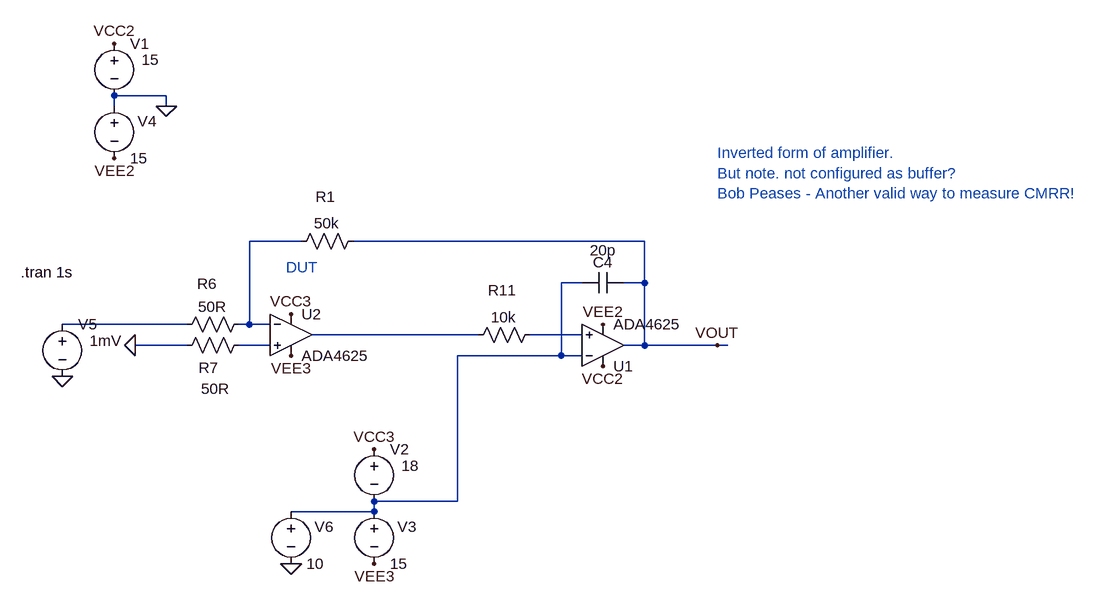
[diagram p0: schematic Draft55.asc]
Draft55.asc, the LTspice schematic file:
Version 4
SHEET 1 2668 952
WIRE 944 -304 864 -304
WIRE 864 -288 864 -304
WIRE 944 -288 944 -304
WIRE 1152 -80 1072 -80
WIRE 1680 -80 1232 -80
WIRE 1584 -16 1552 -16
WIRE 1680 -16 1680 -80
WIRE 1680 -16 1648 -16
WIRE 976 48 784 48
WIRE 1072 48 1072 -80
WIRE 1072 48 1056 48
WIRE 1104 48 1072 48
WIRE 1424 64 1168 64
WIRE 1584 64 1504 64
WIRE 976 80 896 80
WIRE 1104 80 1056 80
WIRE 1680 80 1680 -16
WIRE 1680 80 1648 80
WIRE 1792 80 1680 80
WIRE 1808 80 1792 80
WIRE 1552 96 1552 -16
WIRE 1552 96 1392 96
WIRE 1584 96 1552 96
WIRE 1392 320 1392 96
WIRE 1392 320 1264 320
WIRE 1264 336 1264 320
WIRE 1264 336 1136 336
FLAG 944 -288 0
FLAG 864 -384 VCC2
FLAG 864 -208 VEE2
FLAG 896 80 0
FLAG 1616 112 VCC2
FLAG 1616 48 VEE2
FLAG 1264 240 VCC3
FLAG 1264 416 VEE3
FLAG 1136 32 VCC3
FLAG 1136 96 VEE3
FLAG 1792 80 VOUT
FLAG 784 128 0
FLAG 1136 416 0
SYMBOL voltage 864 -400 R0
WINDOW 123 0 0 Left 0
WINDOW 39 0 0 Left 0
WINDOW 3 42 41 Left 2
SYMATTR Value 15
SYMATTR InstName V1
SYMBOL voltage 864 -304 R0
WINDOW 123 0 0 Left 0
WINDOW 39 0 0 Left 0
WINDOW 0 36 39 Left 2
SYMATTR InstName V4
SYMATTR Value 15
SYMBOL OpAmps\\ADA4625 1136 0 R0
SYMATTR InstName U2
SYMBOL res 1072 32 R90
WINDOW 0 -31 65 VBottom 2
WINDOW 3 -27 57 VTop 2
SYMATTR InstName R6
SYMATTR Value 50R
SYMBOL res 1072 64 R90
WINDOW 0 66 63 VBottom 2
WINDOW 3 67 52 VTop 2
SYMATTR InstName R7
SYMATTR Value 50R
SYMBOL voltage 1264 224 R0
WINDOW 123 0 0 Left 0
WINDOW 39 0 0 Left 0
WINDOW 3 42 41 Left 2
SYMATTR Value 18
SYMATTR InstName V2
SYMBOL voltage 1264 320 R0
WINDOW 123 0 0 Left 0
WINDOW 39 0 0 Left 0
WINDOW 0 36 39 Left 2
SYMATTR InstName V3
SYMATTR Value 15
SYMBOL cap 1648 -32 R90
WINDOW 0 0 32 VBottom 2
WINDOW 3 -50 32 VTop 2
SYMATTR InstName C4
SYMATTR Value 20p
SYMBOL res 1520 48 R90
WINDOW 0 -37 59 VBottom 2
WINDOW 3 -27 57 VTop 2
SYMATTR InstName R11
SYMATTR Value 10k
SYMBOL res 1248 -96 R90
WINDOW 0 -37 59 VBottom 2
WINDOW 3 -27 57 VTop 2
SYMATTR InstName R1
SYMATTR Value 50k
SYMBOL OpAmps\\ADA4625 1616 144 M180
SYMATTR InstName U1
SYMBOL voltage 784 32 R0
WINDOW 123 0 0 Left 0
WINDOW 39 0 0 Left 0
WINDOW 3 42 41 Left 2
SYMATTR Value 1mV
SYMATTR InstName V5
SYMBOL voltage 1136 320 R0
WINDOW 123 0 0 Left 0
WINDOW 39 0 0 Left 0
WINDOW 0 36 39 Left 2
SYMATTR InstName V6
SYMATTR Value 10
TEXT 720 -32 Left 2 !.tran 1s
TEXT 1792 -216 Left 2 ;Inverted form of amplifier.\nBut note. not configured as buffer?\nBob Peases - Another valid way to measure CMRR!
TEXT 1128 -40 Left 2 ;DUT

The netlist it stands for:
* Draft55.asc
V1 VCC2 0 15
V4 0 VEE2 15
XU2 N006 N001 VCC3 VEE3 N004 ADA4625  ; pins In+ In- V+ V- OUT
R6 N001 N003 50R
R7 N006 0 50R
V2 VCC3 N002 18
V3 N002 VEE3 15
C4 VOUT N002 20p
R11 N005 N004 10k
R1 VOUT N001 50k
XU1 N005 N002 VCC2 VEE2 VOUT ADA4625  ; pins In+ In- V+ V- OUT
V5 N003 0 1mV
V6 N002 0 10
.tran 1s
* Inverted form of amplifier.
* But note. not configured as buffer?
* Bob Peases - Another valid way to measure CMRR!
* DUT
.backanno
.end